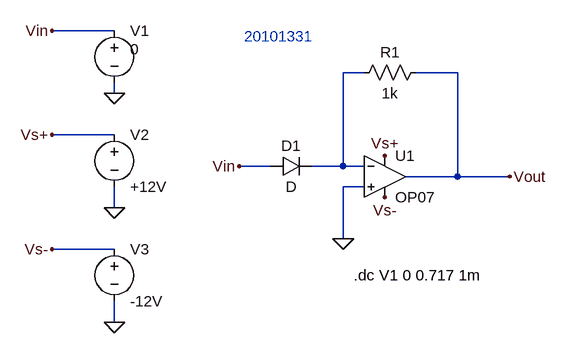
[diagram p0: schematic Exponential amplifier.asc]
Exponential amplifier.asc, the LTspice schematic file:
Version 4
SHEET 1 880 680
WIRE -112 -144 -208 -144
WIRE 272 -80 240 -80
WIRE 416 -80 352 -80
WIRE -112 -48 -112 -64
WIRE -112 16 -208 16
WIRE 128 64 80 64
WIRE 240 64 240 -80
WIRE 240 64 192 64
WIRE 272 64 240 64
WIRE 416 80 416 -80
WIRE 416 80 336 80
WIRE 496 80 416 80
WIRE 272 96 240 96
WIRE -112 128 -112 96
WIRE 240 176 240 96
WIRE -112 192 -208 192
WIRE -112 304 -112 272
FLAG -112 -48 0
FLAG -112 128 0
FLAG -112 304 0
FLAG 304 48 Vs+
FLAG 304 112 Vs-
FLAG -208 16 Vs+
FLAG -208 192 Vs-
FLAG -208 -144 Vin
FLAG 496 80 Vout
FLAG 240 176 0
FLAG 80 64 Vin
SYMBOL OpAmps\\OP07 304 16 R0
SYMATTR InstName U1
SYMBOL voltage -112 -160 R0
WINDOW 123 0 0 Left 0
WINDOW 39 0 0 Left 0
WINDOW 3 24 44 Left 2
SYMATTR InstName V1
SYMATTR Value 0
SYMBOL voltage -112 0 R0
WINDOW 123 0 0 Left 0
WINDOW 39 0 0 Left 0
SYMATTR InstName V2
SYMATTR Value +12V
SYMBOL voltage -112 176 R0
WINDOW 123 0 0 Left 0
WINDOW 39 0 0 Left 0
SYMATTR InstName V3
SYMATTR Value -12V
SYMBOL res 368 -96 R90
WINDOW 0 0 56 VBottom 2
WINDOW 3 32 56 VTop 2
SYMATTR InstName R1
SYMATTR Value 1k
SYMBOL diode 128 80 R270
WINDOW 0 32 32 VTop 2
WINDOW 3 0 32 VBottom 2
SYMATTR InstName D1
TEXT 88 -136 Left 2 ;20101331
TEXT 256 232 Left 2 !.dc V1 0 0.717 1m

The netlist it stands for:
* Exponential amplifier.asc
XU1 0 N001 Vs+ Vs- Vout LT1001  ; OP07, pins In+ In- V+ V- OUT
V1 Vin 0 0
V2 Vs+ 0 +12V
V3 Vs- 0 -12V
R1 Vout N001 1k
D1 Vin N001 D
.model D D
.lib standard.dio
* 20101331
.dc V1 0 0.717 1m
.lib LTC.lib
.backanno
.end